# EAGLE design LED_POV_RGB (EAGLE 7.2.0)
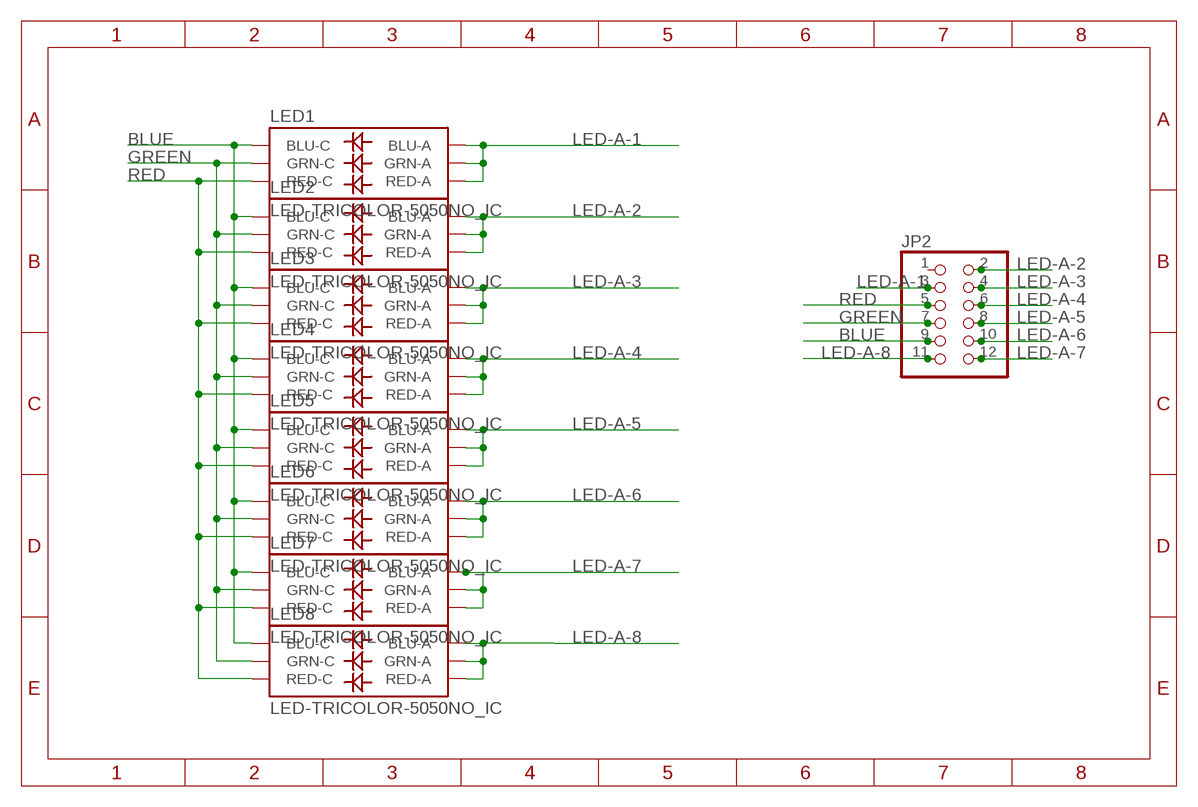
[diagram p0: schematic, sheet 1]

## Parts
JP2  PINHD-2X6  [2X06]
LED1  LED-TRICOLOR-5050NO_IC  [LED-TRICOLOR-5050]
LED2  LED-TRICOLOR-5050NO_IC  [LED-TRICOLOR-5050]
LED3  LED-TRICOLOR-5050NO_IC  [LED-TRICOLOR-5050]
LED4  LED-TRICOLOR-5050NO_IC  [LED-TRICOLOR-5050]
LED5  LED-TRICOLOR-5050NO_IC  [LED-TRICOLOR-5050]
LED6  LED-TRICOLOR-5050NO_IC  [LED-TRICOLOR-5050]
LED7  LED-TRICOLOR-5050NO_IC  [LED-TRICOLOR-5050]
LED8  LED-TRICOLOR-5050NO_IC  [LED-TRICOLOR-5050]

## Nets
BLUE: JP2.9 LED1.4(BLU-C) LED2.4(BLU-C) LED3.4(BLU-C) LED4.4(BLU-C) LED5.4(BLU-C) LED6.4(BLU-C) LED7.4(BLU-C) LED8.4(BLU-C)
GREEN: JP2.7 LED1.6(GRN-C) LED2.6(GRN-C) LED3.6(GRN-C) LED4.6(GRN-C) LED5.6(GRN-C) LED6.6(GRN-C) LED7.6(GRN-C) LED8.6(GRN-C)
LED-A-1: JP2.3 LED1.1(GRN-A) LED1.2(RED-A) LED1.3(BLU-A)
LED-A-2: JP2.2 LED2.1(GRN-A) LED2.2(RED-A) LED2.3(BLU-A)
LED-A-3: JP2.4 LED3.1(GRN-A) LED3.2(RED-A) LED3.3(BLU-A)
LED-A-4: JP2.6 LED4.1(GRN-A) LED4.2(RED-A) LED4.3(BLU-A)
LED-A-5: JP2.8 LED5.1(GRN-A) LED5.2(RED-A) LED5.3(BLU-A)
LED-A-6: JP2.10 LED6.1(GRN-A) LED6.2(RED-A) LED6.3(BLU-A)
LED-A-7: JP2.12 LED7.1(GRN-A) LED7.2(RED-A) LED7.3(BLU-A)
LED-A-8: JP2.11 LED8.1(GRN-A) LED8.2(RED-A) LED8.3(BLU-A)
RED: JP2.5 LED1.5(RED-C) LED2.5(RED-C) LED3.5(RED-C) LED4.5(RED-C) LED5.5(RED-C) LED6.5(RED-C) LED7.5(RED-C) LED8.5(RED-C)
Unconnected: JP2.1

## Library data of the parts
JP2 = pinhead:PINHD-2X6: PIN HEADER
LED1-LED8 = SparkFun-LED:LED-TRICOLOR-5050

## Board
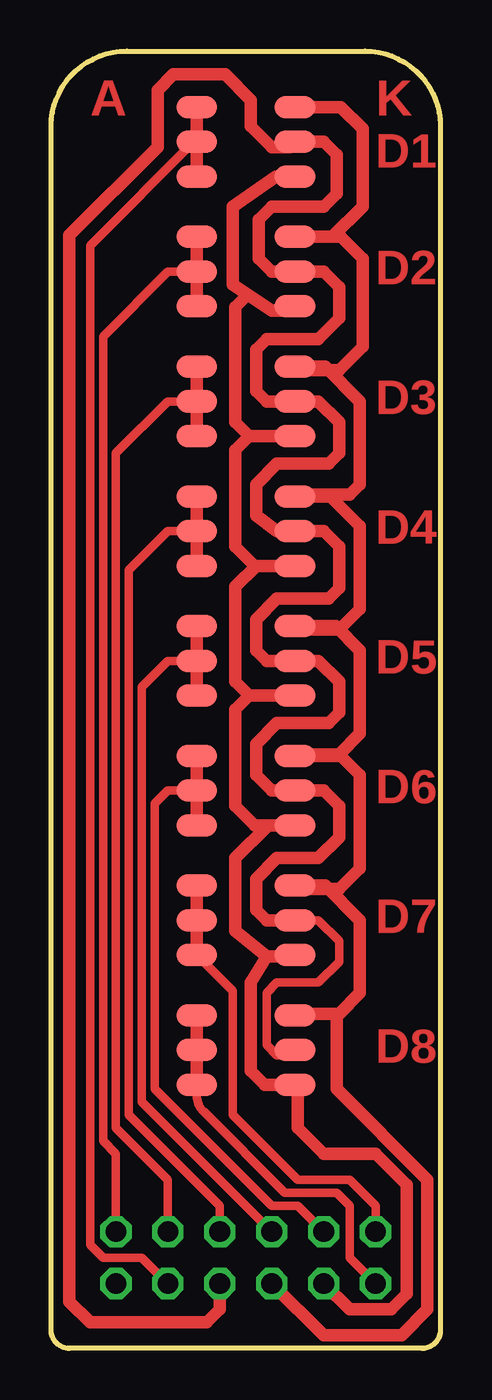
[diagram p1: board, top side]

Size 19.05 x 63.5 mm. Coordinates in mm from the lower left corner, seen from the top.
Outline: 19.05,59.8 19.05,0.9 arc-90 18.15,0 0.9,0 arc-90 0,0.9 0,59.8 arc-90 3.7,63.5 15.35,63.5 arc-90 19.05,59.8
Copper layers (1*16): Top 0.035mm / dielectric 1.5mm / Bottom 0.035mm
Design rules "default": minimum track width 10mil, minimum drill 24mil, track to track 8mil, track to pad 8mil, pad to pad 8mil, via to via 8mil, smd to smd 8mil, copper to edge 40mil, drill to drill 8mil, minimum pad ring 10mil, minimum via ring 8mil, stop-mask expansion 4mil, vias tented up to drill 0mil, thermal gap 10mil

### Footprints (pad centres in the part's own frame; a part is rotated, then mirrored left to right if it is on the bottom)
2X06 = drill 1.016 octagon: 1 -6.35,-1.27; 2 -6.35,1.27; 3 -3.81,-1.27; 4 -3.81,1.27; 5 -1.27,-1.27; 6 -1.27,1.27; 7 1.27,-1.27; 8 1.27,1.27; 9 3.81,-1.27; 10 3.81,1.27; 11 6.35,-1.27; 12 6.35,1.27
LED-TRICOLOR-5050 = smd 2 x 1.1: 1 -2.4,1.7; 2 -2.4,0; 3 -2.4,-1.7; 4 2.4,-1.7; 5 2.4,0; 6 2.4,1.7

### Placement (x,y rotation side)
JP2  9.53,4.45 0 top
LED1  9.53,59.06 0 top
LED2  9.53,52.7 0 top
LED3  9.53,46.36 0 top
LED4  9.53,40 0 top
LED5  9.53,33.66 0 top
LED6  9.53,27.3 0 top
LED7  9.53,20.95 0 top
LED8  9.53,14.61 0 top

### Tracks (layer width: path | path; a pad name or v marks a point on that pad's centre or on a via)
BLUE
  Top 0.61: LED1.4 11,57.36 8.89,55.88 8.89,52.07 9.62,51.58 | 9.62,51.58 10.79,50.8 11.72,50.8 LED2.4 | LED3.4 9.7,44.66 | 9.7,44.66 9.02,45.34 9.02,50.98 9.62,51.58 | LED4.4 10.03,38.31 | 10.03,38.31 9.96,38.31 9.02,39.24 9.02,43.97 9.7,44.66 | LED5.4 9.7,31.95 | 9.7,31.95 9.02,32.64 9.02,37.29 10.03,38.31 | 9.7,31.95 9.02,31.27 9.02,26.54 9.96,25.61 LED6.4 10.62,25.61 9.02,24 9.02,20.45 10.54,19.18 | 10.54,19.18 11.59,19.18 LED7.4 | 10.54,19.18 9.78,17.91 9.78,13.59 10.46,12.91 LED8.4 12.07,12.77 12.07,10.79 13.34,9.53 15.88,9.53 17.4,8 17.4,2.67 16.64,1.9 14.61,1.9 JP2.9
GREEN
  Top 0.61: LED1.6 14.18,60.75 15.24,59.69 15.24,55.88 13.77,54.41 LED2.6 14.18,54.41 15.24,53.34 15.24,49.02 14.1,47.88 12.1,47.88 LED3.6 13.41,48.06 15.11,46.36 15.11,42.29 14.61,41.78 12,41.78 LED4.6 13.67,41.7 15.11,40.26 15.11,36.2 14.1,35.18 12.1,35.18 LED5.6 13.92,35.36 15.11,34.16 15.11,30.1 14.1,29.08 12,29.08 LED6.6 14.18,29 15.11,28.07 15.11,23.5 14.1,22.48 12.1,22.48 LED7.6 13.41,22.66 15.11,20.95 15.11,17.4 14.1,16.38 | 14.1,16.38 12,16.38 LED8.6 | JP2.7 13.34,0.63 17.14,0.63 18.41,1.9 18.41,8.25 13.97,12.7 13.97,16.26 14.1,16.38
LED-A-1
  Top 0.406: LED1.2 6.99,59.06 1.91,53.97 1.91,5.08 2.54,4.45 4.45,4.45 JP2.3
  Top 0.61: LED1.1 LED1.2 LED1.3
LED-A-2
  Top 0.406: JP2.2 3.18,9.53 2.54,10.16 2.54,49.53 5.71,52.7 LED2.2
  Top 0.61: LED2.3 LED2.2 LED2.1
LED-A-3
  Top 0.406: JP2.4 5.71,8.25 3.18,10.79 3.18,43.81 5.71,46.36 LED3.2
  Top 0.61: LED3.3 LED3.2 LED3.1
LED-A-4
  Top 0.406: JP2.6 8.26,6.98 3.81,11.43 3.81,12.26 3.81,12.7 3.81,38.1 5.71,40 LED4.2
  Top 0.61: LED4.3 LED4.2 LED4.1
LED-A-5
  Top 0.406: JP2.8 4.45,12.06 4.45,32.39 5.71,33.66 LED5.2
  Top 0.61: LED5.1 LED5.2 LED5.3
LED-A-6
  Top 0.406: LED6.2 5.71,27.3 5.08,26.67 5.08,12.7 10.79,6.98 12.07,6.98 JP2.10
  Top 0.61: LED6.1 LED6.2 LED6.3
LED-A-7
  Top 0.406: JP2.12 15.88,6.98 14.61,8.25 12.07,8.25 8.89,11.43 8.89,17.49 LED7.3 7.19,19.19
  Top 0.61: LED7.1 LED7.2 LED7.3
LED-A-8
  Top 0.406: JP2.11 14.61,4.45 14.61,6.98 13.97,7.62 11.43,7.62 7.46,11.59 arc-45 7.12,12.4 LED8.3 | 7.12,15.73 6.99,15.88 6.99,16.16 LED8.1
  Top 0.61: 7.12,15.73 LED8.2 LED8.3
RED
  Top 0.406: LED7.5 13.08,20.95 14.1,19.94 14.1,18.92 13.08,17.91 11.05,17.91 10.54,17.4 10.54,14.86 11.05,14.35 11.67,14.35 LED8.5
  Top 0.61: LED7.5 10.54,20.95 10.03,21.46 10.03,22.99 11.05,24 13.08,24 14.1,25.02 14.1,26.54 13.34,27.3 LED6.5 10.79,27.3 10.03,28.07 10.03,29.59 11.05,30.61 13.59,30.61 14.1,31.11 14.1,32.64 13.08,33.66 LED5.5 10.54,33.66 10.03,34.16 10.03,35.69 11.05,36.7 13.59,36.7 14.1,37.21 14.1,39.24 13.34,40 LED4.5 11.67,39.75 11.05,40 10.03,40.77 10.03,42.29 11.05,43.31 13.59,43.31 14.1,43.81 14.1,45.34 13.08,46.36 LED3.5 10.54,46.36 10.03,46.86 10.03,48.89 10.54,49.4 13.08,49.4 14.1,50.42 14.1,51.94 13.34,52.7 LED2.5 10.79,52.7 10.16,53.34 10.16,55.25 10.79,55.88 13.34,55.88 13.97,56.52 13.97,58.42 13.34,59.06 LED1.5 11.67,58.8 10.79,58.8 9.78,59.82 9.78,61.09 8.51,62.36 5.97,62.36 5.21,61.59 5.21,58.8 0.89,54.48 0.89,2.29 1.91,1.27 7.62,1.27 8.26,1.9 JP2.5

### Text on the board
Top: A | K | D1 | D2 | D3 | D4 | D5 | D6 | D7 | D8